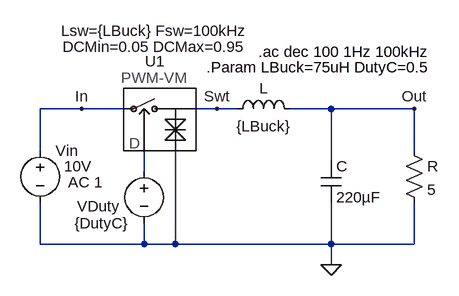
[diagram p0: schematic Buck-VM-Input Rejection Open.asc]
Buck-VM-Input Rejection Open.asc, the LTspice schematic file:
Version 4
SHEET 1 880 696
WIRE 16 48 -48 48
WIRE 80 48 16 48
WIRE 224 48 192 48
WIRE 256 48 224 48
WIRE 400 48 336 48
WIRE 528 48 400 48
WIRE -48 112 -48 48
WIRE 528 112 528 48
WIRE 400 128 400 48
WIRE 112 144 112 112
WIRE -48 256 -48 192
WIRE 112 256 112 224
WIRE 112 256 -48 256
WIRE 160 256 160 112
WIRE 160 256 112 256
WIRE 400 256 400 192
WIRE 400 256 160 256
WIRE 528 256 528 192
WIRE 528 256 400 256
WIRE 400 288 400 256
FLAG 400 288 0
FLAG 16 48 In
FLAG 528 48 Out
FLAG 224 48 Swt
SYMBOL voltage -48 96 R0
WINDOW 123 43 65 Left 2
WINDOW 39 0 0 Left 2
WINDOW 3 37 40 Left 2
SYMATTR Value2 AC 1
SYMATTR Value 10V
SYMATTR InstName Vin
SYMBOL ind 240 64 R270
WINDOW 0 32 56 VTop 2
WINDOW 3 5 56 VBottom 2
SYMATTR InstName L
SYMATTR Value {LBuck}
SYMBOL cap 384 128 R0
SYMATTR InstName C
SYMATTR Value 220µF
SYMATTR SpiceLine Rser=70m
SYMBOL res 512 96 R0
SYMATTR InstName R
SYMATTR Value 5
SYMBOL voltage 112 128 M0
WINDOW 0 38 70 Left 2
SYMATTR InstName VDuty
SYMATTR Value {DutyC}
SYMBOL PWM\\PWM-VM 128 64 R0
SYMATTR InstName U1
SYMATTR SpiceLine2 Lsw={LBuck} Fsw=100kHz
TEXT 208 -16 Left 2 !.Param LBuck=75uH DutyC=0.5
TEXT 288 -40 Left 2 !.ac dec 100 1Hz 100kHz

The netlist it stands for:
* Buck-VM-Input Rejection Open.asc
Vin In 0 10V AC 1
L Swt Out {LBuck}
C Out 0 220µF Rser=70m
R Out 0 5
VDuty N001 0 {DutyC}
XU1 In Swt 0 N001 PWM-VM params: DCMin=0.05 DCMax=0.95 Lsw={LBuck} Fsw=100kHz  ; pins nA nC nP nD
.Param LBuck=75uH DutyC=0.5
.ac dec 100 1Hz 100kHz
.backanno
.end